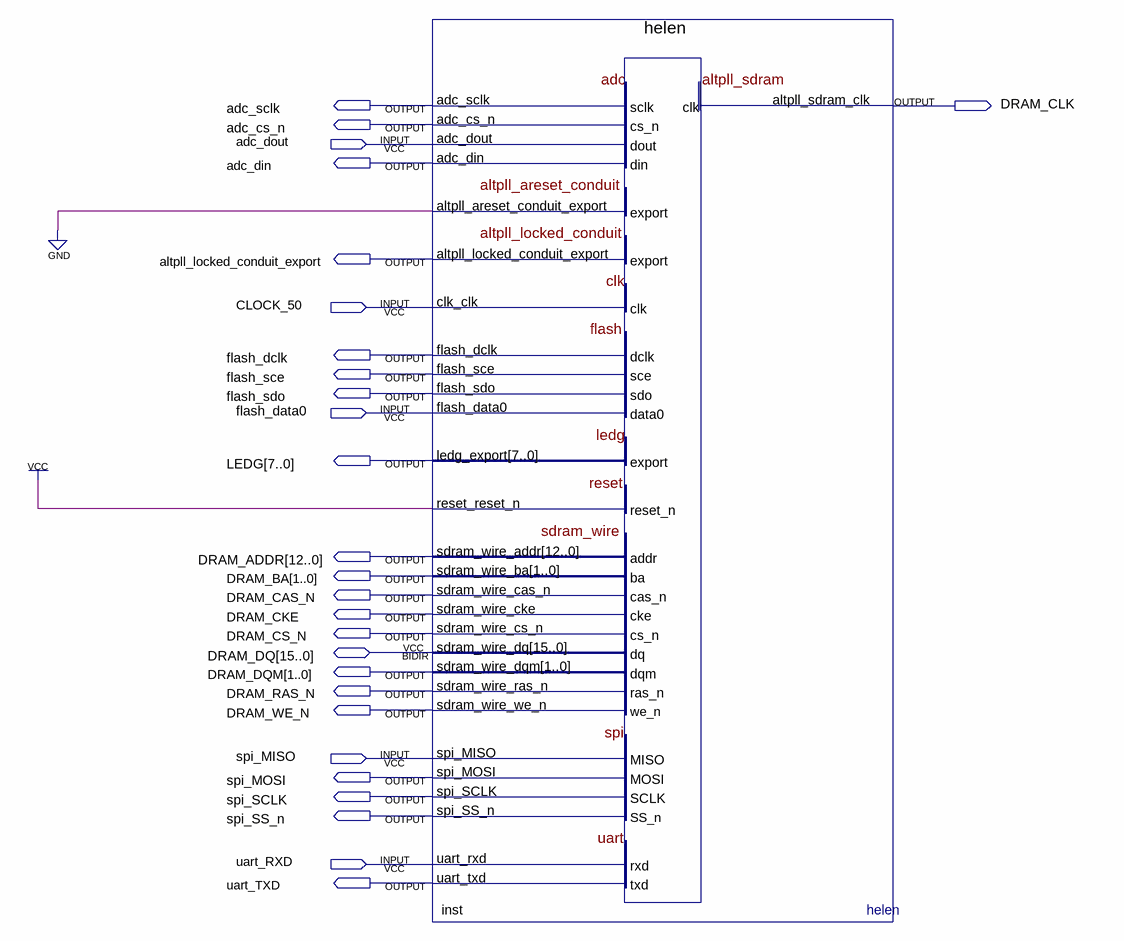
[diagram p0: schematic sheet]
// Quartus schematic top.bdf as structural Verilog: 1 symbols, 27 pins
module top (
  input  adc_dout,
  input  CLOCK_50,
  input  flash_data0,
  input  spi_MISO,
  input  uart_RXD,
  inout  [15:0] DRAM_DQ,
  output adc_sclk,
  output DRAM_CLK,
  output adc_cs_n,
  output adc_din,
  output altpll_locked_conduit_export,
  output flash_dclk,
  output flash_sce,
  output flash_sdo,
  output [7:0] LEDG,
  output [12:0] DRAM_ADDR,
  output [1:0] DRAM_BA,
  output DRAM_CAS_N,
  output DRAM_CKE,
  output DRAM_CS_N,
  output [1:0] DRAM_DQM,
  output DRAM_RAS_N,
  output DRAM_WE_N,
  output spi_MOSI,
  output spi_SCLK,
  output spi_SS_n,
  output uart_TXD
);

  helen inst (
    .adc_dout(adc_dout), .altpll_areset_conduit_export(1'b0), .clk_clk(CLOCK_50), .flash_data0(flash_data0),
    .reset_reset_n(1'b1), .spi_MISO(spi_MISO), .uart_rxd(uart_RXD), .adc_sclk(adc_sclk), .adc_cs_n(adc_cs_n),
    .adc_din(adc_din), .altpll_locked_conduit_export(altpll_locked_conduit_export),
    .altpll_sdram_clk(DRAM_CLK), .flash_dclk(flash_dclk), .flash_sce(flash_sce), .flash_sdo(flash_sdo),
    .ledg_export(LEDG), .sdram_wire_addr(DRAM_ADDR), .sdram_wire_ba(DRAM_BA), .sdram_wire_cas_n(DRAM_CAS_N),
    .sdram_wire_cke(DRAM_CKE), .sdram_wire_cs_n(DRAM_CS_N), .sdram_wire_dqm(DRAM_DQM),
    .sdram_wire_ras_n(DRAM_RAS_N), .sdram_wire_we_n(DRAM_WE_N), .spi_MOSI(spi_MOSI), .spi_SCLK(spi_SCLK),
    .spi_SS_n(spi_SS_n), .uart_txd(uart_TXD), .sdram_wire_dq(DRAM_DQ));
endmodule
